# Altium schematic sheet fpga-config.SCHDOC: FPGA Configuration and Decoupling
size A3; Organization: Berne University of Applied Science; Address1: School of Engineering and; Address2: Information Technology; Address3: Quellgasse 21; Address4: CH-2501 Biel; Revision: 1.0; SheetNumber: 5; SheetTotal: 19; ApprovedBy: zem1; Author: zac1
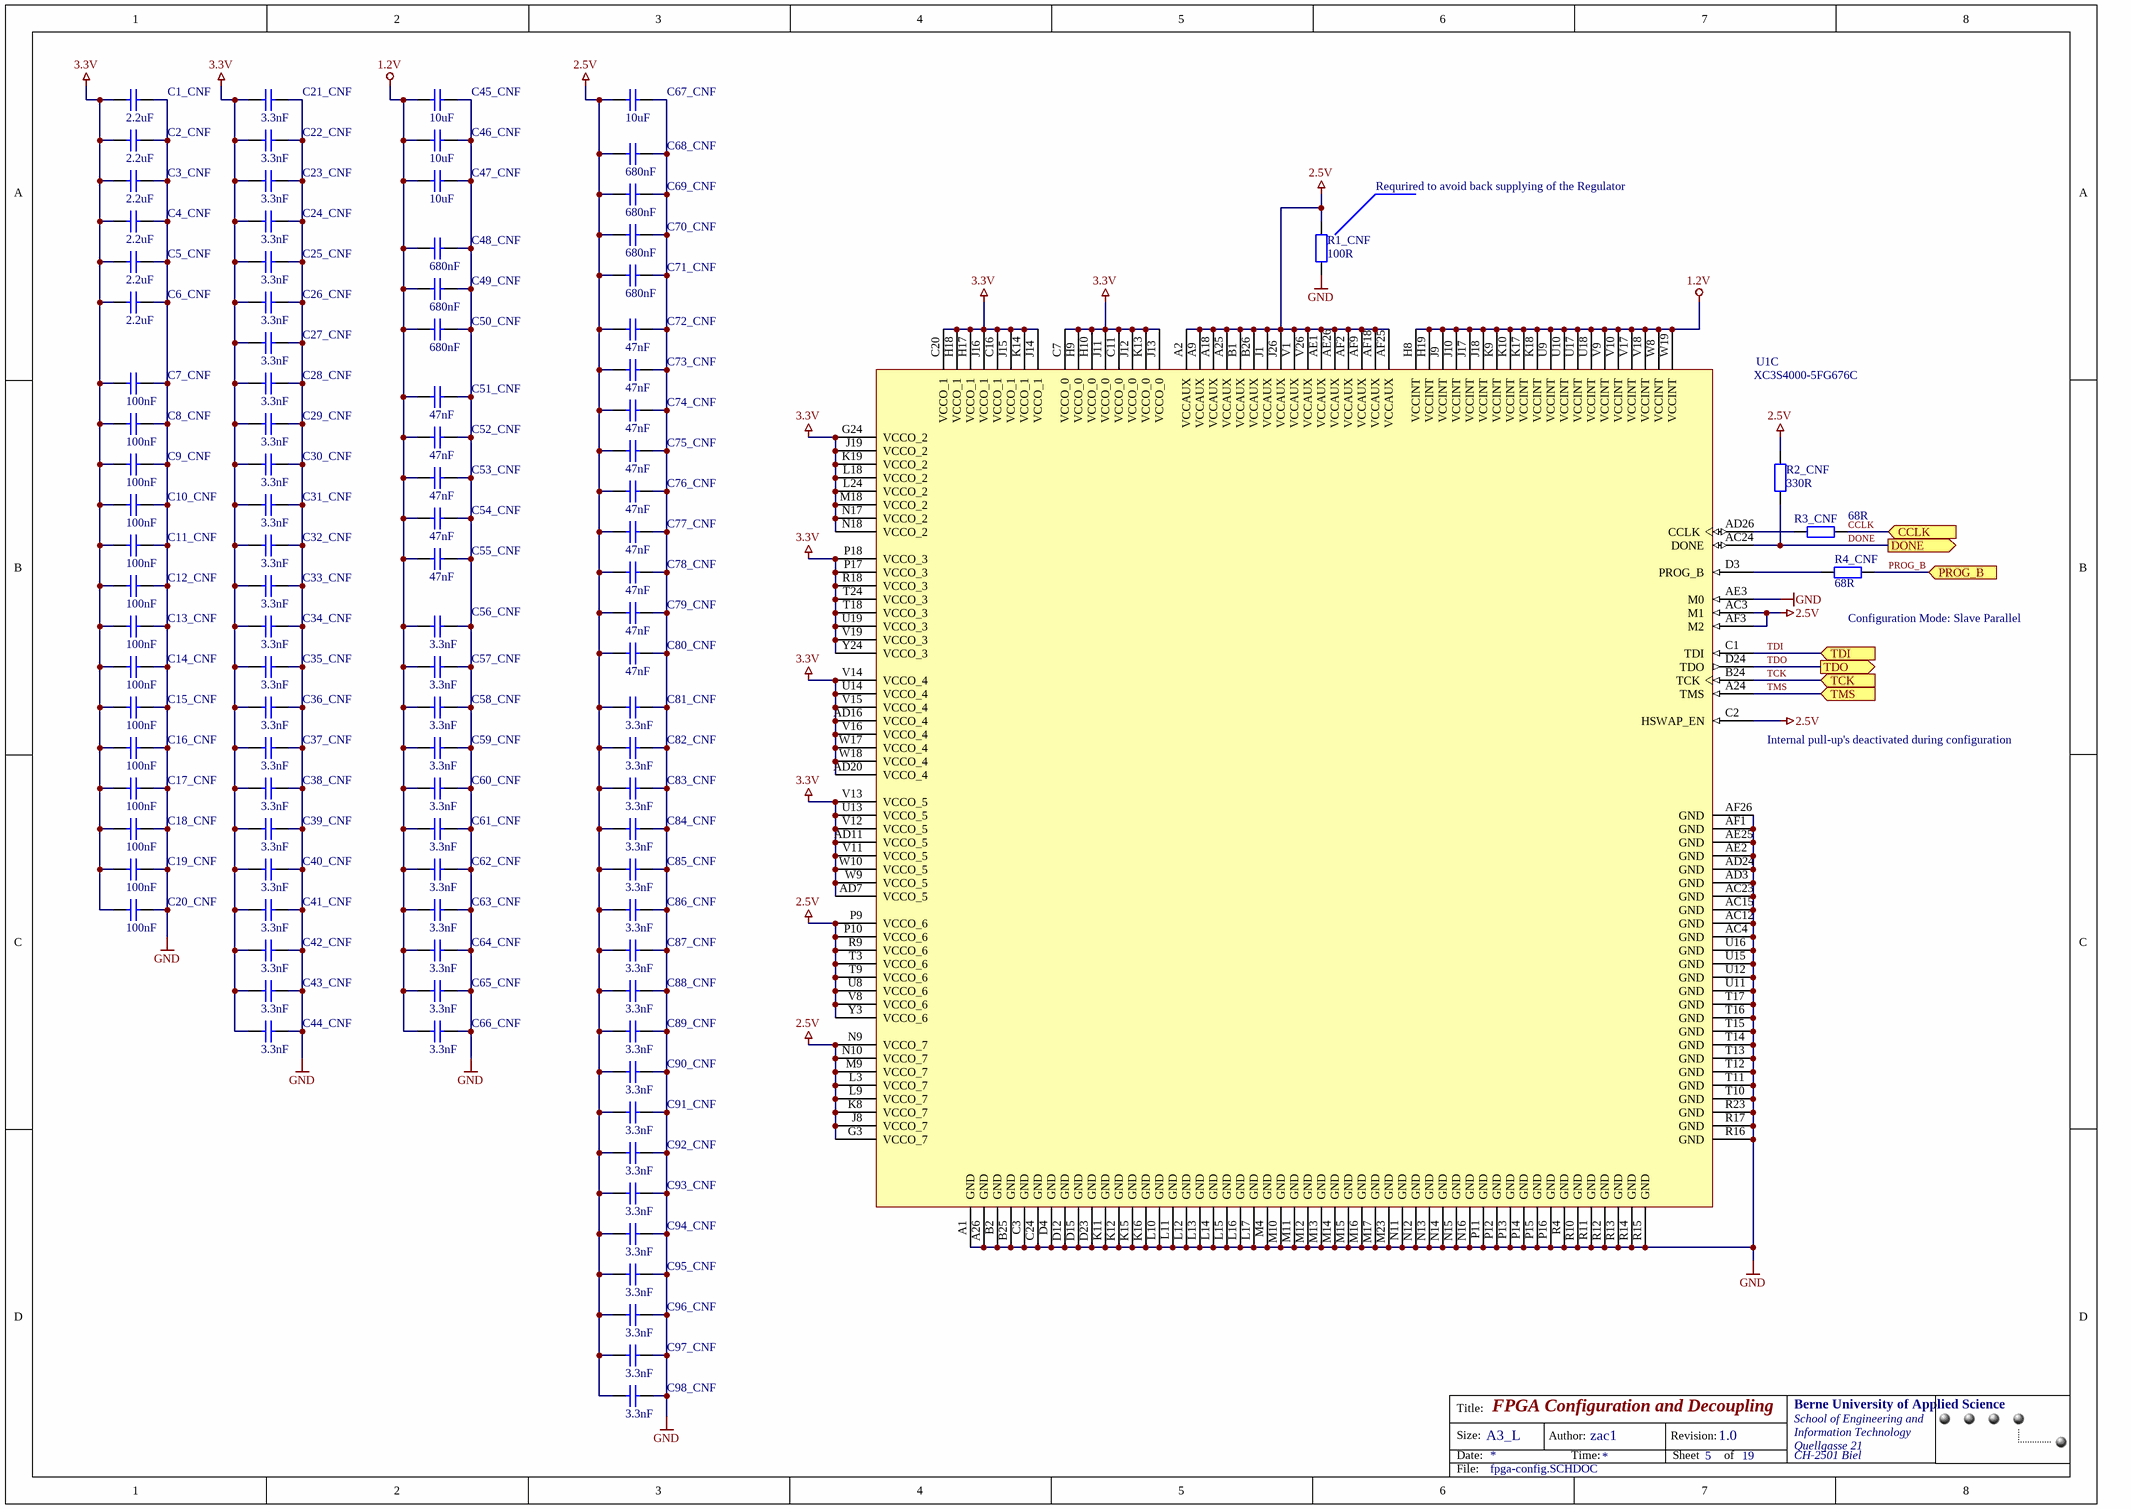
[diagram p0: fpga-config.SCHDOC]

## Parts
C1_CNF  value 2.2uF  [0805]  (hidden comment: Cap)
C2_CNF  value 2.2uF  [0805]  (hidden comment: Cap)
C3_CNF  value 2.2uF  [0805]  (hidden comment: Cap)
C4_CNF  value 2.2uF  [0805]  (hidden comment: Cap)
C5_CNF  value 2.2uF  [0805]  (hidden comment: Cap)
C6_CNF  value 2.2uF  [0805]  (hidden comment: Cap)
C7_CNF  value 100nF  [0402]  (hidden comment: Cap)
C8_CNF  value 100nF  [0402]  (hidden comment: Cap)
C9_CNF  value 100nF  [0402]  (hidden comment: Cap)
C10_CNF  value 100nF  [0402]  (hidden comment: Cap)
C11_CNF  value 100nF  [0402]  (hidden comment: Cap)
C12_CNF  value 100nF  [0402]  (hidden comment: Cap)
C13_CNF  value 100nF  [0402]  (hidden comment: Cap)
C14_CNF  value 100nF  [0402]  (hidden comment: Cap)
C15_CNF  value 100nF  [0402]  (hidden comment: Cap)
C16_CNF  value 100nF  [0402]  (hidden comment: Cap)
C17_CNF  value 100nF  [0402]  (hidden comment: Cap)
C18_CNF  value 100nF  [0402]  (hidden comment: Cap)
C19_CNF  value 100nF  [0402]  (hidden comment: Cap)
C20_CNF  value 100nF  [0402]  (hidden comment: Cap)
C21_CNF  value 3.3nF  [0402]  (hidden comment: Cap)
C22_CNF  value 3.3nF  [0402]  (hidden comment: Cap)
C23_CNF  value 3.3nF  [0402]  (hidden comment: Cap)
C24_CNF  value 3.3nF  [0402]  (hidden comment: Cap)
C25_CNF  value 3.3nF  [0402]  (hidden comment: Cap)
C26_CNF  value 3.3nF  [0402]  (hidden comment: Cap)
C27_CNF  value 3.3nF  [0402]  (hidden comment: Cap)
C28_CNF  value 3.3nF  [0402]  (hidden comment: Cap)
C29_CNF  value 3.3nF  [0402]  (hidden comment: Cap)
C30_CNF  value 3.3nF  [0402]  (hidden comment: Cap)
C31_CNF  value 3.3nF  [0402]  (hidden comment: Cap)
C32_CNF  value 3.3nF  [0402]  (hidden comment: Cap)
C33_CNF  value 3.3nF  [0402]  (hidden comment: Cap)
C34_CNF  value 3.3nF  [0402]  (hidden comment: Cap)
C35_CNF  value 3.3nF  [0402]  (hidden comment: Cap)
C36_CNF  value 3.3nF  [0402]  (hidden comment: Cap)
C37_CNF  value 3.3nF  [0402]  (hidden comment: Cap)
C38_CNF  value 3.3nF  [0402]  (hidden comment: Cap)
C39_CNF  value 3.3nF  [0402]  (hidden comment: Cap)
C40_CNF  value 3.3nF  [0402]  (hidden comment: Cap)
C41_CNF  value 3.3nF  [0402]  (hidden comment: Cap)
C42_CNF  value 3.3nF  [0402]  (hidden comment: Cap)
C43_CNF  value 3.3nF  [0402]  (hidden comment: Cap)
C44_CNF  value 3.3nF  [0402]  (hidden comment: Cap)
C45_CNF  value 10uF  [1206]  (hidden comment: Cap)
C46_CNF  value 10uF  [1206]  (hidden comment: Cap)
C47_CNF  value 10uF  [1206]  (hidden comment: Cap)
C48_CNF  value 680nF  [0805]  (hidden comment: Cap)
C49_CNF  value 680nF  [0805]  (hidden comment: Cap)
C50_CNF  value 680nF  [0805]  (hidden comment: Cap)
C51_CNF  value 47nF  [0402]  (hidden comment: Cap)
C52_CNF  value 47nF  [0402]  (hidden comment: Cap)
C53_CNF  value 47nF  [0402]  (hidden comment: Cap)
C54_CNF  value 47nF  [0402]  (hidden comment: Cap)
C55_CNF  value 47nF  [0402]  (hidden comment: Cap)
C56_CNF  value 3.3nF  [0402]  (hidden comment: Cap)
C57_CNF  value 3.3nF  [0402]  (hidden comment: Cap)
C58_CNF  value 3.3nF  [0402]  (hidden comment: Cap)
C59_CNF  value 3.3nF  [0402]  (hidden comment: Cap)
C60_CNF  value 3.3nF  [0402]  (hidden comment: Cap)
C61_CNF  value 3.3nF  [0402]  (hidden comment: Cap)
C62_CNF  value 3.3nF  [0402]  (hidden comment: Cap)
C63_CNF  value 3.3nF  [0402]  (hidden comment: Cap)
C64_CNF  value 3.3nF  [0402]  (hidden comment: Cap)
C65_CNF  value 3.3nF  [0402]  (hidden comment: Cap)
C66_CNF  value 3.3nF  [0402]  (hidden comment: Cap)
C67_CNF  value 10uF  [1206]  (hidden comment: Cap)
C68_CNF  value 680nF  [0805]  (hidden comment: Cap)
C69_CNF  value 680nF  [0805]  (hidden comment: Cap)
C70_CNF  value 680nF  [0805]  (hidden comment: Cap)
C71_CNF  value 680nF  [0805]  (hidden comment: Cap)
C72_CNF  value 47nF  [0402]  (hidden comment: Cap)
C73_CNF  value 47nF  [0402]  (hidden comment: Cap)
C74_CNF  value 47nF  [0402]  (hidden comment: Cap)
C75_CNF  value 47nF  [0402]  (hidden comment: Cap)
C76_CNF  value 47nF  [0402]  (hidden comment: Cap)
C77_CNF  value 47nF  [0402]  (hidden comment: Cap)
C78_CNF  value 47nF  [0402]  (hidden comment: Cap)
C79_CNF  value 47nF  [0402]  (hidden comment: Cap)
C80_CNF  value 47nF  [0402]  (hidden comment: Cap)
C81_CNF  value 3.3nF  [0402]  (hidden comment: Cap)
C82_CNF  value 3.3nF  [0402]  (hidden comment: Cap)
C83_CNF  value 3.3nF  [0402]  (hidden comment: Cap)
C84_CNF  value 3.3nF  [0402]  (hidden comment: Cap)
C85_CNF  value 3.3nF  [0402]  (hidden comment: Cap)
C86_CNF  value 3.3nF  [0402]  (hidden comment: Cap)
C87_CNF  value 3.3nF  [0402]  (hidden comment: Cap)
C88_CNF  value 3.3nF  [0402]  (hidden comment: Cap)
C89_CNF  value 3.3nF  [0402]  (hidden comment: Cap)
C90_CNF  value 3.3nF  [0402]  (hidden comment: Cap)
C91_CNF  value 3.3nF  [0402]  (hidden comment: Cap)
C92_CNF  value 3.3nF  [0402]  (hidden comment: Cap)
C93_CNF  value 3.3nF  [0402]  (hidden comment: Cap)
C94_CNF  value 3.3nF  [0402]  (hidden comment: Cap)
C95_CNF  value 3.3nF  [0402]  (hidden comment: Cap)
C96_CNF  value 3.3nF  [0402]  (hidden comment: Cap)
C97_CNF  value 3.3nF  [0402]  (hidden comment: Cap)
C98_CNF  value 3.3nF  [0402]  (hidden comment: Cap)
R1_CNF  value 100R  [0402]  (hidden comment: Res2)
R2_CNF  value 330R  [0402]  (hidden comment: Res2)
R3_CNF  value 68R  [0402]  (hidden comment: Res2)
R4_CNF  value 68R  [0402]  (hidden comment: Res2)
U1  XC3S4000-5FG676C  [FG676]  (part C of 3)

## Ports
CCLK (in), DONE (out), PROG_B (in), TCK (in), TDI (in), TDO (out), TMS (in)

## Nets
1.2V: C45_CNF.2 C46_CNF.2 C47_CNF.2 C48_CNF.2 C49_CNF.2 C50_CNF.2 C51_CNF.2 C52_CNF.2 C53_CNF.2 C54_CNF.2 C55_CNF.2 C56_CNF.2 C57_CNF.2 C58_CNF.2 C59_CNF.2 C60_CNF.2 C61_CNF.2 C62_CNF.2 C63_CNF.2 C64_CNF.2 C65_CNF.2 C66_CNF.2 U1.H8(VCCINT) U1.H19(VCCINT) U1.J9(VCCINT) U1.J10(VCCINT) U1.J17(VCCINT) U1.J18(VCCINT) U1.K9(VCCINT) U1.K10(VCCINT) U1.K17(VCCINT) U1.K18(VCCINT) U1.U9(VCCINT) U1.U10(VCCINT) U1.U17(VCCINT) U1.U18(VCCINT) U1.V9(VCCINT) U1.V10(VCCINT) U1.V17(VCCINT) U1.V18(VCCINT) U1.W8(VCCINT) U1.W19(VCCINT)
2.5V: C67_CNF.2 C68_CNF.2 C69_CNF.2 C70_CNF.2 C71_CNF.2 C72_CNF.2 C73_CNF.2 C74_CNF.2 C75_CNF.2 C76_CNF.2 C77_CNF.2 C78_CNF.2 C79_CNF.2 C80_CNF.2 C81_CNF.2 C82_CNF.2 C83_CNF.2 C84_CNF.2 C85_CNF.2 C86_CNF.2 C87_CNF.2 C88_CNF.2 C89_CNF.2 C90_CNF.2 C91_CNF.2 C92_CNF.2 C93_CNF.2 C94_CNF.2 C95_CNF.2 C96_CNF.2 C97_CNF.2 C98_CNF.2 R1_CNF.1 R2_CNF.1 U1.A2(VCCAUX) U1.A9(VCCAUX) U1.A18(VCCAUX) U1.A25(VCCAUX) U1.AC3(M1) U1.AE1(VCCAUX) U1.AE26(VCCAUX) U1.AF2(VCCAUX) U1.AF3(M2) U1.AF9(VCCAUX) U1.AF18(VCCAUX) U1.AF25(VCCAUX) U1.B1(VCCAUX) U1.B26(VCCAUX) U1.C2(HSWAP_EN) U1.G3(VCCO_7) U1.J1(VCCAUX) U1.J8(VCCO_7) U1.J26(VCCAUX) U1.K8(VCCO_7) U1.L3(VCCO_7) U1.L9(VCCO_7) U1.M9(VCCO_7) U1.N9(VCCO_7) U1.N10(VCCO_7) U1.P9(VCCO_6) U1.P10(VCCO_6) U1.R9(VCCO_6) U1.T3(VCCO_6) U1.T9(VCCO_6) U1.U8(VCCO_6) U1.V1(VCCAUX) U1.V8(VCCO_6) U1.V26(VCCAUX) U1.Y3(VCCO_6)
3.3V: C1_CNF.1 C2_CNF.1 C3_CNF.1 C4_CNF.1 C5_CNF.1 C6_CNF.1 C7_CNF.2 C8_CNF.2 C9_CNF.2 C10_CNF.2 C11_CNF.2 C12_CNF.2 C13_CNF.2 C14_CNF.2 C15_CNF.2 C16_CNF.2 C17_CNF.2 C18_CNF.2 C19_CNF.2 C20_CNF.2 C21_CNF.2 C22_CNF.2 C23_CNF.2 C24_CNF.2 C25_CNF.2 C26_CNF.2 C27_CNF.2 C28_CNF.2 C29_CNF.2 C30_CNF.2 C31_CNF.2 C32_CNF.2 C33_CNF.2 C34_CNF.2 C35_CNF.2 C36_CNF.2 C37_CNF.2 C38_CNF.2 C39_CNF.2 C40_CNF.2 C41_CNF.2 C42_CNF.2 C43_CNF.2 C44_CNF.2 U1.AD7(VCCO_5) U1.AD11(VCCO_5) U1.AD16(VCCO_4) U1.AD20(VCCO_4) U1.C7(VCCO_0) U1.C11(VCCO_0) U1.C16(VCCO_1) U1.C20(VCCO_1) U1.G24(VCCO_2) U1.H9(VCCO_0) U1.H10(VCCO_0) U1.H17(VCCO_1) U1.H18(VCCO_1) U1.J11(VCCO_0) U1.J12(VCCO_0) U1.J13(VCCO_0) U1.J14(VCCO_1) U1.J15(VCCO_1) U1.J16(VCCO_1) U1.J19(VCCO_2) U1.K13(VCCO_0) U1.K14(VCCO_1) U1.K19(VCCO_2) U1.L18(VCCO_2) U1.L24(VCCO_2) U1.M18(VCCO_2) U1.N17(VCCO_2) U1.N18(VCCO_2) U1.P17(VCCO_3) U1.P18(VCCO_3) U1.R18(VCCO_3) U1.T18(VCCO_3) U1.T24(VCCO_3) U1.U13(VCCO_5) U1.U14(VCCO_4) U1.U19(VCCO_3) U1.V11(VCCO_5) U1.V12(VCCO_5) U1.V13(VCCO_5) U1.V14(VCCO_4) U1.V15(VCCO_4) U1.V16(VCCO_4) U1.V19(VCCO_3) U1.W9(VCCO_5) U1.W10(VCCO_5) U1.W17(VCCO_4) U1.W18(VCCO_4) U1.Y24(VCCO_3)
GND: C1_CNF.2 C2_CNF.2 C3_CNF.2 C4_CNF.2 C5_CNF.2 C6_CNF.2 C7_CNF.1 C8_CNF.1 C9_CNF.1 C10_CNF.1 C11_CNF.1 C12_CNF.1 C13_CNF.1 C14_CNF.1 C15_CNF.1 C16_CNF.1 C17_CNF.1 C18_CNF.1 C19_CNF.1 C20_CNF.1 C21_CNF.1 C22_CNF.1 C23_CNF.1 C24_CNF.1 C25_CNF.1 C26_CNF.1 C27_CNF.1 C28_CNF.1 C29_CNF.1 C30_CNF.1 C31_CNF.1 C32_CNF.1 C33_CNF.1 C34_CNF.1 C35_CNF.1 C36_CNF.1 C37_CNF.1 C38_CNF.1 C39_CNF.1 C40_CNF.1 C41_CNF.1 C42_CNF.1 C43_CNF.1 C44_CNF.1 C45_CNF.1 C46_CNF.1 C47_CNF.1 C48_CNF.1 C49_CNF.1 C50_CNF.1 C51_CNF.1 C52_CNF.1 C53_CNF.1 C54_CNF.1 C55_CNF.1 C56_CNF.1 C57_CNF.1 C58_CNF.1 C59_CNF.1 C60_CNF.1 C61_CNF.1 C62_CNF.1 C63_CNF.1 C64_CNF.1 C65_CNF.1 C66_CNF.1 C67_CNF.1 C68_CNF.1 C69_CNF.1 C70_CNF.1 C71_CNF.1 C72_CNF.1 C73_CNF.1 C74_CNF.1 C75_CNF.1 C76_CNF.1 C77_CNF.1 C78_CNF.1 C79_CNF.1 C80_CNF.1 C81_CNF.1 C82_CNF.1 C83_CNF.1 C84_CNF.1 C85_CNF.1 C86_CNF.1 C87_CNF.1 C88_CNF.1 C89_CNF.1 C90_CNF.1 C91_CNF.1 C92_CNF.1 C93_CNF.1 C94_CNF.1 C95_CNF.1 C96_CNF.1 C97_CNF.1 C98_CNF.1 R1_CNF.2 U1.A1(GND) U1.A26(GND) U1.AC4(GND) U1.AC12(GND) U1.AC15(GND) U1.AC23(GND) U1.AD3(GND) U1.AD24(GND) U1.AE2(GND) U1.AE3(M0) U1.AE25(GND) U1.AF1(GND) U1.AF26(GND) U1.B2(GND) U1.B25(GND) U1.C3(GND) U1.C24(GND) U1.D4(GND) U1.D12(GND) U1.D15(GND) U1.D23(GND) U1.K11(GND) U1.K12(GND) U1.K15(GND) U1.K16(GND) U1.L10(GND) U1.L11(GND) U1.L12(GND) U1.L13(GND) U1.L14(GND) U1.L15(GND) U1.L16(GND) U1.L17(GND) U1.M4(GND) U1.M10(GND) U1.M11(GND) U1.M12(GND) U1.M13(GND) U1.M14(GND) U1.M15(GND) U1.M16(GND) U1.M17(GND) U1.M23(GND) U1.N11(GND) U1.N12(GND) U1.N13(GND) U1.N14(GND) U1.N15(GND) U1.N16(GND) U1.P11(GND) U1.P12(GND) U1.P13(GND) U1.P14(GND) U1.P15(GND) U1.P16(GND) U1.R4(GND) U1.R10(GND) U1.R11(GND) U1.R12(GND) U1.R13(GND) U1.R14(GND) U1.R15(GND) U1.R16(GND) U1.R17(GND) U1.R23(GND) U1.T10(GND) U1.T11(GND) U1.T12(GND) U1.T13(GND) U1.T14(GND) U1.T15(GND) U1.T16(GND) U1.T17(GND) U1.U11(GND) U1.U12(GND) U1.U15(GND) U1.U16(GND)
CCLK: R3_CNF.1 ; port CCLK
DONE: R2_CNF.2 U1.AC24(DONE) ; port DONE
PROG_B: R4_CNF.1 ; port PROG_B
TCK: U1.B24(TCK) ; port TCK
TDI: U1.C1(TDI) ; port TDI
TDO: U1.D24(TDO) ; port TDO
TMS: U1.A24(TMS) ; port TMS
NetR3_CNF_2: R3_CNF.2 U1.AD26(CCLK)
NetR4_CNF_2: R4_CNF.2 U1.D3(PROG_B)

## Notes on the sheet
- Requrired to avoid back supplying of the Regulator
- (near R4_CNF) Configuration Mode: Slave Parallel
- Internal pull-up's deactivated during configuration
- Title:
- Size:
- Date:
- A3_L
- Author:
- Time:
- Revision:
- Sheet
- of
- File:

## Library data of the parts
C1_CNF C2_CNF C3_CNF C4_CNF C5_CNF C6_CNF = Cap: Capacitor; Manufacturer: Murata; Part Number: GRM21BR71A225KA01L; Class I: Passive; Currency: CHF; Packaging unit: 1; Prize: 0.54; Published: 8-Jun-2000; Revision: July-2002: Re-released for DXP Platform.; Publisher: Altium Limited; Class II: Capacitor; Distributor Number: 823 517; RoHS: yes; Distributor: Distrelec
C7_CNF C8_CNF C9_CNF C10_CNF C11_CNF C12_CNF C13_CNF C14_CNF C15_CNF C16_CNF C17_CNF C18_CNF C19_CNF C20_CNF = Cap: Capacitor; Manufacturer: Murata; Part Number: GRM155R71C104KA88D; Class I: Passive; Currency: CHF; Packaging unit: 10; Prize: 0.07; Published: 8-Jun-2000; Revision: July-2002: Re-released for DXP Platform.; Publisher: Altium Limited; Class II: Capacitor; Distributor Number: 8819 742; RoHS: yes; Distributor: Farnell
C21_CNF C22_CNF C23_CNF C24_CNF C25_CNF C26_CNF C27_CNF C28_CNF C29_CNF C30_CNF C31_CNF C32_CNF C33_CNF C34_CNF C35_CNF C36_CNF C37_CNF C38_CNF C39_CNF C40_CNF C41_CNF C42_CNF C43_CNF C44_CNF C56_CNF C57_CNF C58_CNF C59_CNF C60_CNF C61_CNF C62_CNF C63_CNF C64_CNF C65_CNF C66_CNF C81_CNF C82_CNF C83_CNF C84_CNF C85_CNF C86_CNF C87_CNF C88_CNF C89_CNF C90_CNF C91_CNF C92_CNF C93_CNF C94_CNF C95_CNF C96_CNF C97_CNF C98_CNF = Cap: Capacitor; Manufacturer: PHYCOMP; Part Number: 2238 587 15629; Class I: Passive; Currency: CHF; Packaging unit: 10; Prize: 0.11; Published: 8-Jun-2000; Revision: July-2002: Re-released for DXP Platform.; Publisher: Altium Limited; Class II: Capacitor; Distributor Number: 3019 410; RoHS: yes; Distributor: Farnell
C45_CNF C46_CNF C47_CNF C67_CNF = Cap: Capacitor; Manufacturer: Murata; Part Number: GRM31CR70J106KA01L; Class I: Passive; Currency: CHF; Packaging unit: 1; Prize: 0.25; Published: 8-Jun-2000; Revision: July-2002: Re-released for DXP Platform.; Publisher: Altium Limited; Class II: Capacitor; Distributor Number: 9527 729; RoHS: yes; Distributor: Farnell
C48_CNF C49_CNF C50_CNF C68_CNF C69_CNF C70_CNF C71_CNF = Cap: Capacitor; Manufacturer: PHYCOMP; Part Number: 2238 240 15661; Class I: Passive; Currency: CHF; Packaging unit: 10; Prize: 0.34; Published: 8-Jun-2000; Revision: July-2002: Re-released for DXP Platform.; Publisher: Altium Limited; Class II: Capacitor; Distributor Number: 3352 055; RoHS: yes; Distributor: Farnell
C51_CNF C52_CNF C53_CNF C54_CNF C55_CNF C72_CNF C73_CNF C74_CNF C75_CNF C76_CNF C77_CNF C78_CNF C79_CNF C80_CNF = Cap: Capacitor; Manufacturer: PHYCOMP; Part Number: 2238 787 19845; Class I: Passive; Currency: CHF; Packaging unit: 10; Prize: 0.15; Published: 8-Jun-2000; Revision: July-2002: Re-released for DXP Platform.; Publisher: Altium Limited; Class II: Capacitor; Distributor Number: 3019 469; RoHS: yes; Distributor: Farnell
R1_CNF = Res2: Resistor; Manufacturer: PHYCOMP; Part Number: 232270671001; Class I: Passive; Currency: CHF; Packaging unit: 50; Prize: 0.12; Published: 8-Jun-2000; Revision: July-2002: Re-released for DXP Platform.; Publisher: Altium Limited; Class II: Resistor; Distributor Number: 9239111; RoHS: yes; Distributor: Farnell
R2_CNF = Res2: Resistor; Manufacturer: PHYCOMP; Part Number: 232270673301; Class I: Passive; Currency: CHF; Packaging unit: 50; Prize: 0.12; Published: 8-Jun-2000; Revision: July-2002: Re-released for DXP Platform.; Publisher: Altium Limited; Class II: Resistor; Distributor Number: 9239170; RoHS: yes; Distributor: Farnell
R3_CNF R4_CNF = Res2: Resistor; Manufacturer: PHYCOMP; Part Number: 232270676809; Class I: Passive; Currency: CHF; Packaging unit: 50; Prize: 0.12; Published: 8-Jun-2000; Revision: July-2002: Re-released for DXP Platform.; Publisher: Altium Limited; Class II: Resistor; Distributor Number: 9239090; RoHS: yes; Distributor: Farnell
U1 = XC3S1500-5FG676C: Spartan-3 1.2V FPGA, 487 User I/Os, 676-ball FBGA, High Performance, Commercial Grade; Manufacturer: Xilinx; PackageDocument: ver1.1, Apr-2001; Currency: CHF; lead time: 6 Weeks; Packaging unit: 40; Prize: 184.72; Published: 17-Sep-2003; LatestRevisionDate: 6-Jun-2005; LatestRevisionNote: Bubble removed from PROG_B pin.; DatasheetDocument: 04-Mar-2004; PackageReference: FG676; Publisher: Altium Limited; Code_JEDEC: MS-034-AAL-1; Code_IPC: PBGA 27X27 FE676; ComponentLink1Description: Manufacturer Link; ComponentLink1URL: http://www.xilinx.com/xlnx/xil_prodcat_landingpage.jsp?title=Spartan-3; ComponentLink2Description: Datasheet; ComponentLink2URL: http://direct.xilinx.com/bvdocs/publications/ds099.pdf; Value: XC3S4000-5FG676C; Distributor Number: XC3S40005FGG676C; Part Number: XC3S4000-5FG676C; RoHS: yes; Distributor: Silica